# EasyEDA schematic POTENTIAL PCB.json
TITLE: Sheet_1; REV: 1.0; Date: 2025-03-06; Sheet: 1/1; Company: Your Company
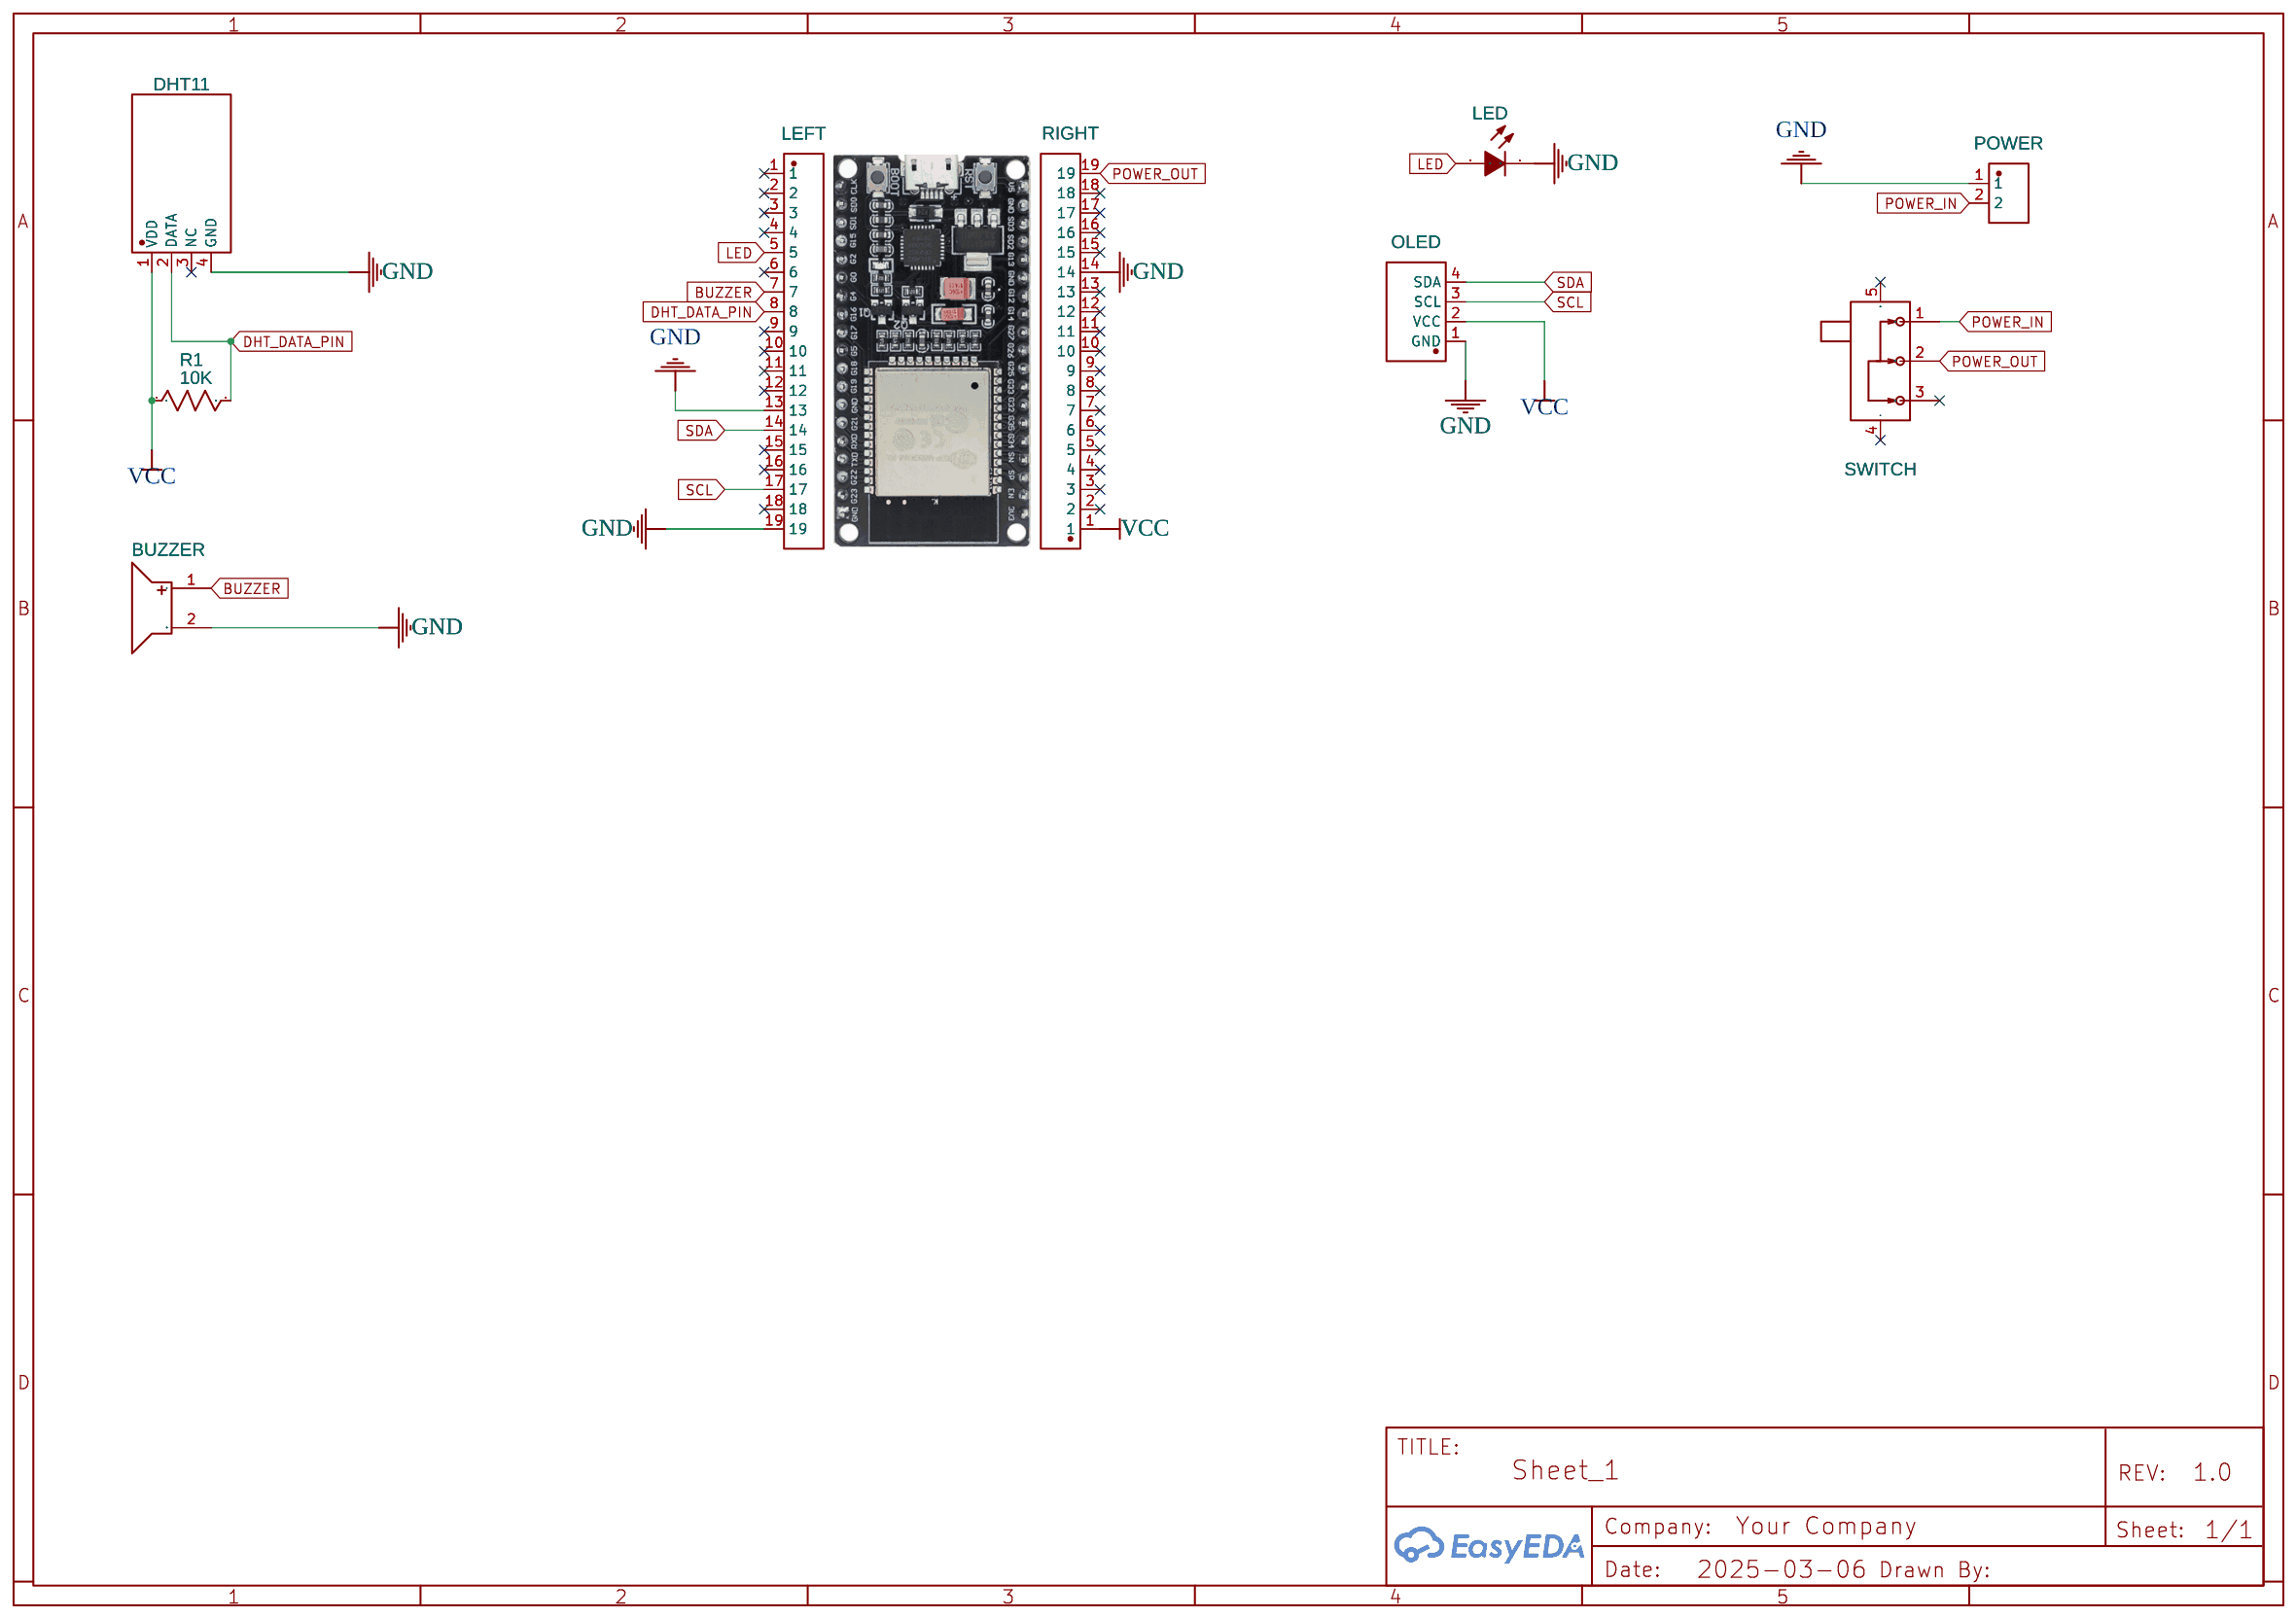
[diagram p0: schematic sheet]

## Parts
BUZZER1  BUZZER  [BUZ-TH_BD6.7-P3.20-D0.8]
DHT11  DHT11  [SENSOR-TH_DHT11]
LED  LED  [LED-TH_BD5.9-P2.54-RD_RED]
LEFT  2.54-1*19P母  [HDR-TH_19P-P2.54-V-F]
OLED  HS96L03W2C03  [OLED-TH_L27.8-W27.2-P2.54_C9900033791]
POWER  DB125-2.54-2P-GN  [CONN-TH_DB125-2.54-2P-GN]
R1  10K  [R0603]
RIGHT  2.54-1*19P母  [HDR-TH_19P-P2.54-V-F]
SWITCH  SS-12D11-G030  [SW-TH_5P-P4.70_SS-12D11-G030]

## Library data of the parts
BUZZER1 = FS6737: Contributor: LCSC; Supplier: LCSC; Supplier Part: C2972844; Manufacturer: FUET(福声科技); JLCPCB Part Class: Extended Part
DHT11 = DHT11: Contributor: LCSC; Supplier: LCSC; Supplier Part: C117051; Manufacturer: 广州奥松; JLCPCB Part Class: Extended Part
LED = 333-2SURD/S530-A3: Supplier: LCSC; Manufacturer: EVERLIGHT(亿光); Supplier Part: C87271; JLCPCB Part Class: Extended Part
LEFT RIGHT = 2.54-1*19P母: Contributor: LCSC; Supplier: LCSC; Supplier Part: C319202; Manufacturer: BOOMELE(博穆精密); JLCPCB Part Class: Extended Part
OLED = HS96L03W2C03: Contributor: lcsc; Supplier: LCSC; Supplier Part: C5248080; Manufacturer: HS(汉昇); JLCPCB Part Class: Extended Part
POWER = DB125-2.54-2P-GN: Contributor: LCSC; Supplier: LCSC; Supplier Part: C918120; Manufacturer: DORABO(地博电气); Manufacturer Part: DB125-2.54-2P-GN-S; JLCPCB Part Class: Extended Part
R1 = R_0603_US: Contributor: LCEDA_Lib
SWITCH = SS-12D11-G030: Supplier: LCSC; Supplier Part: C17179526; Manufacturer: G-Switch(品赞); Contributor: lcsc

## Nets
GND: BUZZER1.2 DHT11.4(GND) LED.1(C) LEFT.13 LEFT.19 OLED.1(GND) POWER.1 RIGHT.14
VCC: DHT11.1(VDD) OLED.2(VCC) R1.1 RIGHT.1
BUZZER: BUZZER1.1 LEFT.7
DHT_DATA_PIN: DHT11.2(DATA) LEFT.8 R1.2
LED: LED.2(A) LEFT.5
POWER_IN: POWER.2 SWITCH.1
POWER_OUT: RIGHT.19 SWITCH.2
SCL: LEFT.17 OLED.3(SCL)
SDA: LEFT.14 OLED.4(SDA)

Not connected (* = marked no-connect by the designer): DHT11 3(NC)*; LEFT 1* 2* 3* 4* 6* 9* 10* 11* 12* 15* 16* 18*; RIGHT 2* 3* 4* 5* 6* 7* 8* 9* 10* 11* 12* 13* 15* 16* 17* 18*; SWITCH 3* 4* 5*
